# EAGLE design guimoOpen_PCB (EAGLE 7.6.0)
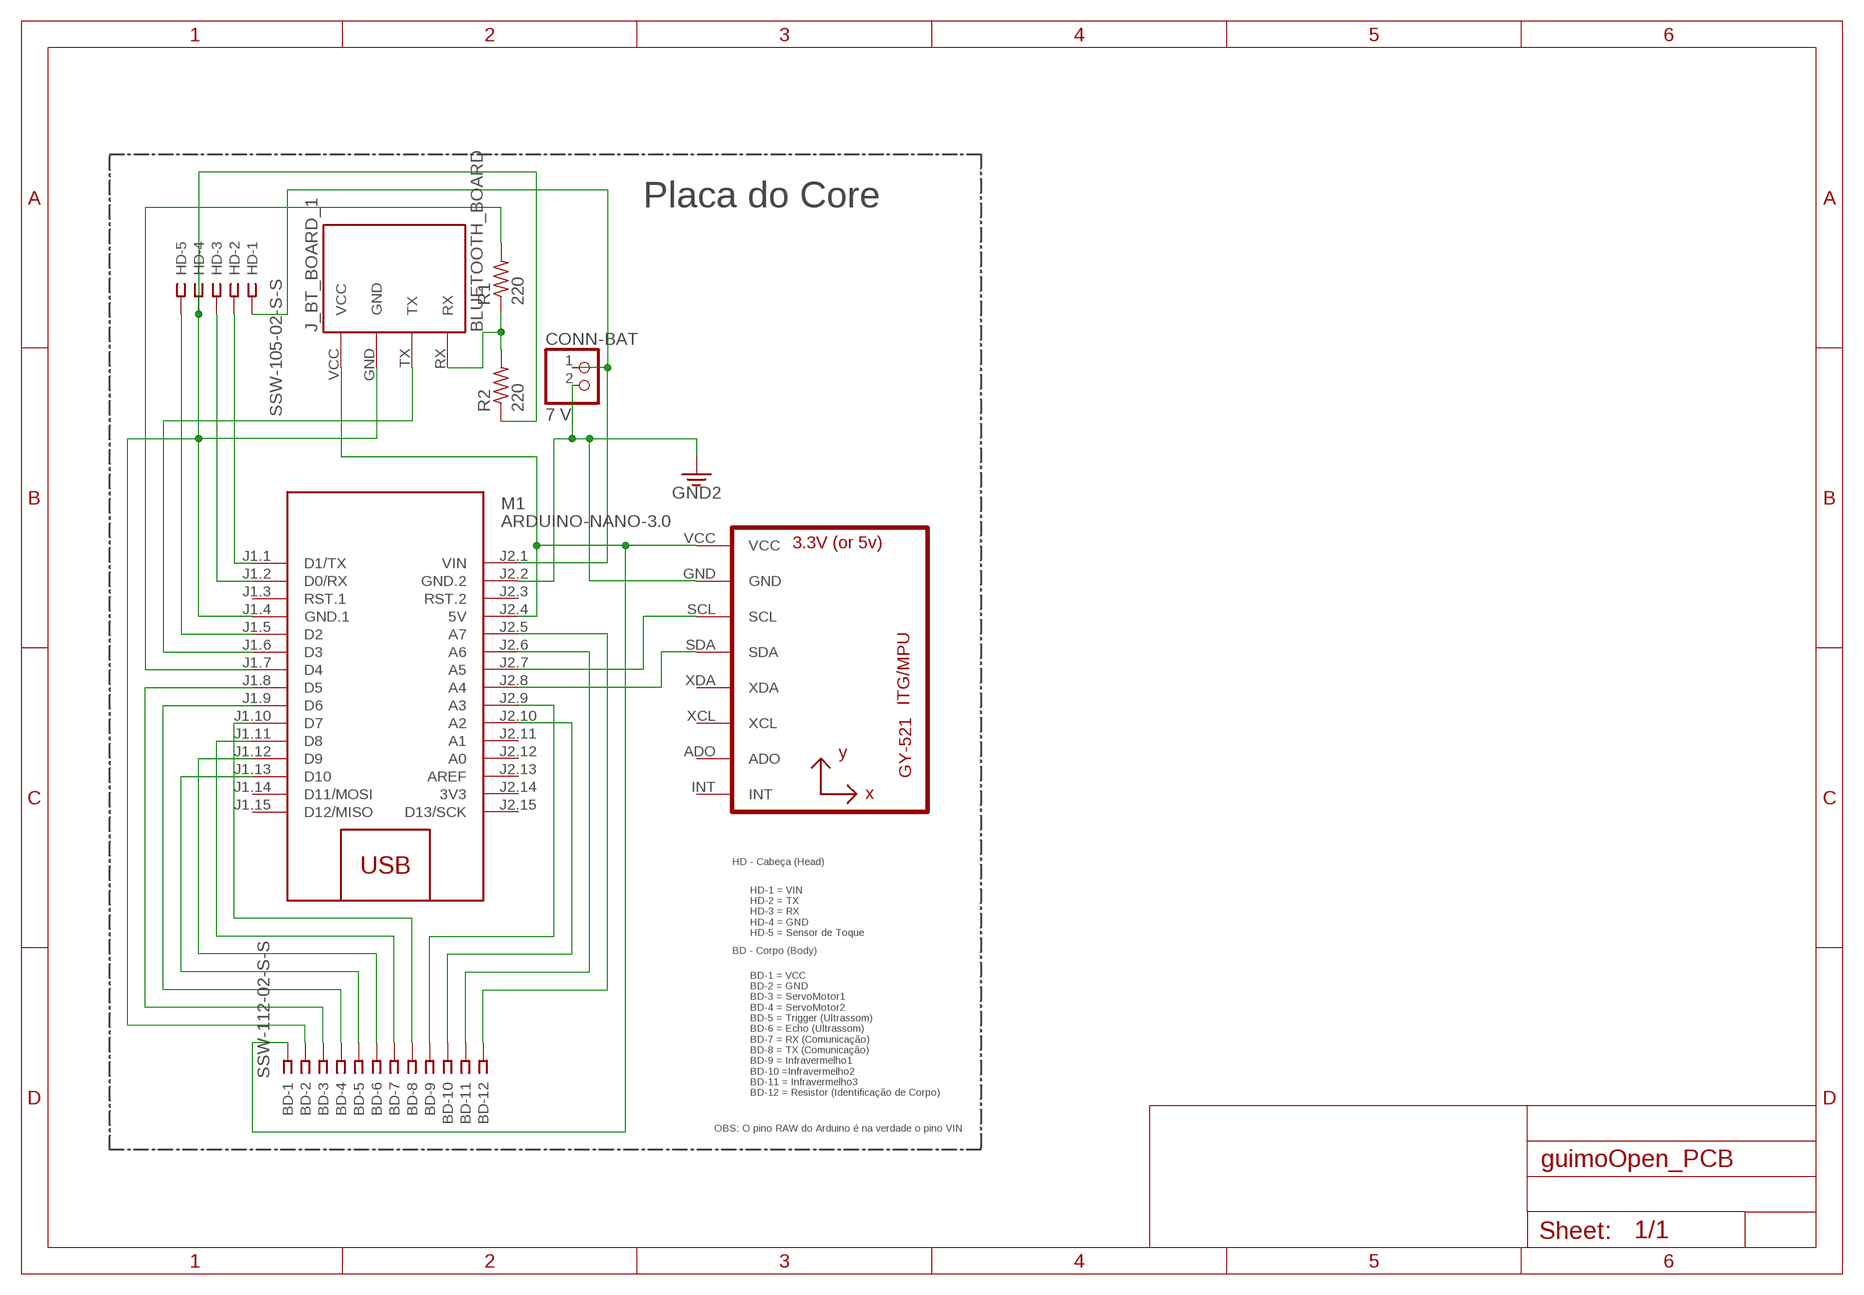
[diagram p0: schematic, sheet 1]

## Parts
BD  SSW-112-02-S-S  [SSW-112-02-S-S]
CONN-BAT  7 V  PINHD-1X2  [1X02]
HD  SSW-105-02-S-S  [SSW-105-02-S-S]
J_BT_BOARD_1  BLUETOOTH_BOARD  [BT_BOARD_FOOTPRINT]
M1  ARDUINO-NANO-3.0  [ARDUINO-NANO-3.0]
R1  220  R-US_0207/7  [0207/7]
R2  220  R-US_0207/7  [0207/7]
U1  GY-521MPU6050  [GY-521]

## Nets
GND: BD.2 HD.4 J_BT_BOARD_1.GND M1.J1.4(GND.1) R2.1
GND1: CONN-BAT.2 M1.J2.2(GND.2) U1.GND ; supply symbol labelled GND2
N$1: J_BT_BOARD_1.RX R1.1 R2.2
N$2: BD.1 J_BT_BOARD_1.VCC M1.J2.4(5V) U1.VCC
N$3: M1.J2.7(A5) U1.SCL
N$4: M1.J2.8(A4) U1.SDA
N$6: HD.5 M1.J1.5(D2)
N$7: CONN-BAT.1 HD.1 M1.J2.1(VIN)
N$8: M1.J1.7(D4) R1.2
N$9: BD.4 M1.J1.9(D6)
N$10: BD.6 M1.J1.12(D9)
N$11: BD.7 M1.J1.11(D8)
N$12: BD.5 M1.J1.13(D10)
N$13: BD.3 M1.J1.8(D5)
N$14: BD.8 M1.J1.10(D7)
N$15: BD.12 M1.J2.5(A7)
N$16: BD.11 M1.J2.6(A6)
N$17: J_BT_BOARD_1.TX M1.J1.6(D3)
N$18: HD.2 M1.J1.1(D1/TX)
N$19: BD.9 M1.J2.9(A3)
N$20: BD.10 M1.J2.10(A2)
N$21: HD.3 M1.J1.2(D0/RX)
Unconnected: M1.J1.3(RST.1) M1.J1.14(D11/MOSI) M1.J1.15(D12/MISO) M1.J2.3(RST.2) M1.J2.11(A1) M1.J2.12(A0) M1.J2.13(AREF) M1.J2.15(D13/SCK) U1.ADO U1.INT U1.XCL U1.XDA

## Notes on the sheet
- Placa do Core
- HD - Cabeça (Head)
- HD-1 = VIN
  HD-2 = TX
  HD-3 = RX
  HD-4 = GND
  HD-5 = Sensor de Toque
- BD - Corpo (Body)
- BD-1 = VCC
  BD-2 = GND
  BD-3 = ServoMotor1
  BD-4 = ServoMotor2
  BD-5 = Trigger (Ultrassom)
  BD-6 = Echo (Ultrassom)
  BD-7 = RX (Comunicação)
  BD-8 = TX (Comunicação)
  BD-9 = Infravermelho1
  BD-10 =Infravermelho2 
  BD-11 = Infravermelho3
  BD-12 = Resistor (Identificação de Corpo)
- OBS: O pino RAW do Arduino é na verdade o pino VIN

## Power pins joined to a net without a drawn wire
3V3: M1.J2.14(3V3)

## Library data of the parts
BD = con-samtec:SSW-112-02-S-S: THROUGH-HOLE .025" SQ POST SOCKET Source: Samtec SSW.pdf; MPN: SSW-112-02-S-S; OC_FARNELL: unknown; OC_NEWARK: 11P9515
CONN-BAT = pinhead:PINHD-1X2: PIN HEADER
HD = con-samtec:SSW-105-02-S-S: THROUGH-HOLE .025" SQ POST SOCKET Source: Samtec SSW.pdf; MPN: SSW-105-02-S-S; OC_FARNELL: unknown; OC_NEWARK: 11P9399
J_BT_BOARD_1 = bluetooth-HC-05:BLUETOOTH_BOARD: Bluetooth Board V1.05
M1 = diy-modules:ARDUINO-NANO-3.0: Arduino Nano 3.0 and compatible devices More details available here: https://www.arduino.cc/en/Main/ArduinoBoardNano Click here to find device on ebay.com <http://www.ebay.com/sch/arduino+nano>
R1 R2 = rcl:R-US_: RESISTOR, American symbol
U1 = gy-521_MPU-6050:GY-521

## Board
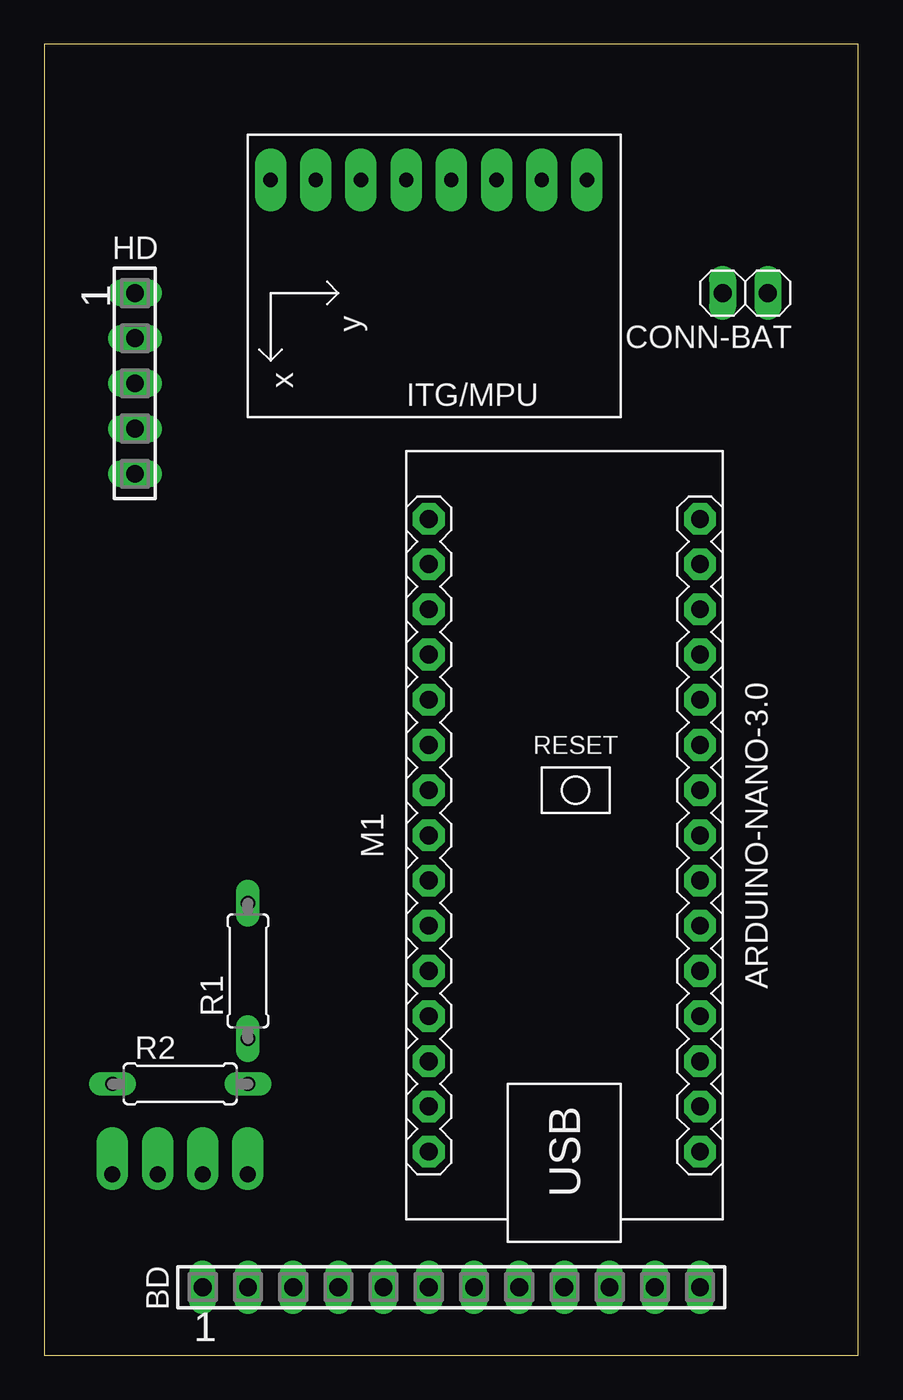
[diagram p1: board, top side]
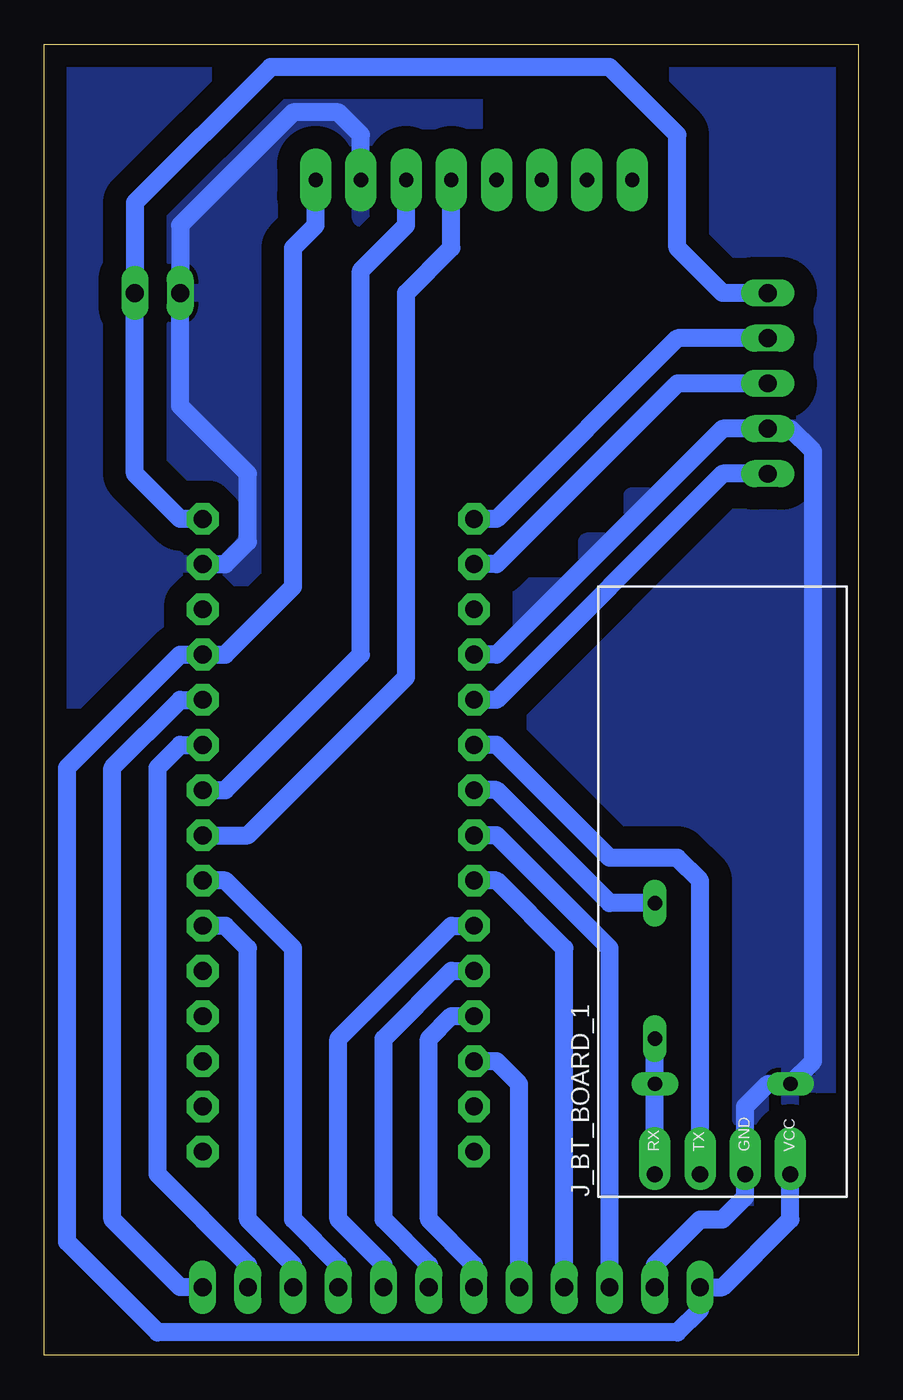
[diagram p2: board, bottom side, seen from below]

Size 45.72 x 73.66 mm. Coordinates in mm from the lower left corner, seen from the top.
Outline: 0,0 45.72,0 45.72,73.66 0,73.66 0,0
Copper layers (1*16): Top 0.035mm / dielectric 1.5mm / Bottom 0.035mm
Design rules "default *": minimum track width 30mil, minimum drill 24mil, track to track 12mil, track to pad 16mil, pad to pad 16mil, via to via 8mil, smd to smd 8mil, copper to edge 40mil, drill to drill 8mil, minimum pad ring 10mil, minimum via ring 8mil, stop-mask expansion 4mil, vias tented up to drill 0mil, thermal gap 10mil

### Footprints (pad centres in the part's own frame; a part is rotated, then mirrored left to right if it is on the bottom)
SSW-112-02-S-S = drill 1 pad 1.5 long: 1 -13.97,0; 2 -11.43,0; 3 -8.89,0; 4 -6.35,0; 5 -3.81,0; 6 -1.27,0; 7 1.27,0; 8 3.81,0; 9 6.35,0; 10 8.89,0; 11 11.43,0; 12 13.97,0
1X02 = drill 1.016 long: 1 -1.27,0; 2 1.27,0
SSW-105-02-S-S = drill 1 pad 1.5 long: 1 -5.08,0; 2 -2.54,0; 3 0,0; 4 2.54,0; 5 5.08,0
BT_BOARD_FOOTPRINT = drill 0.9 pad 1.778 offset: GND -16.51,-1.27; RX -16.51,3.81; TX -16.51,1.27; VCC -16.51,-3.81
ARDUINO-NANO-3.0 = drill 1 pad 1.778 octagon: J1.1 17.78,7.62; J1.2 15.24,7.62; J1.3 12.7,7.62; J1.4 10.16,7.62; J1.5 7.62,7.62; J1.6 5.08,7.62; J1.7 2.54,7.62; J1.8 0,7.62; J1.9 -2.54,7.62; J1.10 -5.08,7.62; J1.11 -7.62,7.62; J1.12 -10.16,7.62; J1.13 -12.7,7.62; J1.14 -15.24,7.62; J1.15 -17.78,7.62; J2.1 17.78,-7.62; J2.2 15.24,-7.62; J2.3 12.7,-7.62; J2.4 10.16,-7.62; J2.5 7.62,-7.62; J2.6 5.08,-7.62; J2.7 2.54,-7.62; J2.8 0,-7.62; J2.9 -2.54,-7.62; J2.10 -5.08,-7.62; J2.11 -7.62,-7.62; J2.12 -10.16,-7.62; J2.13 -12.7,-7.62; J2.14 -15.24,-7.62; J2.15 -17.78,-7.62
0207/7 = drill 0.813 long: 1 -3.81,0; 2 3.81,0
GY-521 = drill 0.8 pad 1.778 long: ADO -8.89,-6.35; GND -8.89,6.35; INT -8.89,-8.89; SCL -8.89,3.81; SDA -8.89,1.27; VCC -8.89,8.89; XCL -8.89,-3.81; XDA -8.89,-1.27

### Placement (x,y rotation side)
BD  22.86,3.81 0 top
CONN-BAT  39.37,59.69 180 top
HD  5.08,54.61 270 top
J_BT_BOARD_1  7.62,26.67 90 bottom
M1  29.21,29.21 90 top
R1  11.43,21.59 90 top
R2  7.62,15.24 0 top
U1  21.59,57.15 270 top

### Tracks (layer width: path | path; a pad name or v marks a point on that pad's centre or on a via)
GND
  Bottom 1.016: BD.2 11.43,5.08 8.89,7.62 7.62,7.62 6.35,8.89 J_BT_BOARD_1.GND 6.35,13.97 5.08,15.24 R2.1 2.54,16.51 2.54,50.8 3.81,52.07 HD.4 7.62,52.07 20.32,39.37 M1.J1.4
  pour Bottom (isolate 1.27): 0,73.66 13.97,73.66 13.97,55.88 5.08,55.88 5.08,50.8 8.89,50.8 8.89,48.26 12.7,48.26 12.7,45.72 15.24,45.72 15.24,43.18 19.05,43.18 19.05,39.37 20.32,39.37 20.32,34.29 20.32,8.89 3.81,8.89 3.81,15.24 0,15.24 0,72.39
GND1
  Bottom 1.016: U1.GND 27.94,68.58 29.21,69.85 31.75,69.85 38.1,63.5 CONN-BAT.2 38.1,53.34 34.29,49.53 34.29,45.72 35.56,44.45 M1.J2.2
  pour Bottom (isolate 1.27): 45.72,73.66 21.59,73.66 21.59,0 45.72,0
N$1
  Bottom 1.016: J_BT_BOARD_1.RX R2.2 R1.1
N$2
  Bottom 1.016: U1.VCC 30.48,63.5 31.75,62.23 31.75,43.18 35.56,39.37 M1.J2.4 38.1,39.37 44.45,33.02 44.45,6.35 39.37,1.27 10.16,1.27 8.89,2.54 BD.1 7.62,3.81 3.81,7.62 J_BT_BOARD_1.VCC
N$3
  Bottom 1.016: M1.J2.7 35.56,31.75 27.94,39.37 27.94,60.96 25.4,63.5 U1.SCL
N$4
  Bottom 1.016: M1.J2.8 34.29,29.21 25.4,38.1 25.4,59.69 22.86,62.23 U1.SDA
N$6
  Bottom 1.016: HD.5 7.62,49.53 20.32,36.83 M1.J1.5
N$7
  Bottom 1.016: M1.J2.1 38.1,46.99 40.64,49.53 CONN-BAT.1 40.64,64.77 33.02,72.39 13.97,72.39 10.16,68.58 10.16,62.23 7.62,59.69 HD.1
N$8
  Bottom 1.016: R1.2 13.97,25.4 20.32,31.75 M1.J1.7
N$9
  Bottom 1.016: BD.4 16.51,22.86 20.32,26.67 M1.J1.9
N$10
  Bottom 1.016: BD.6 21.59,5.08 24.13,7.62 24.13,17.78 22.86,19.05 M1.J1.12
N$11
  Bottom 1.016: BD.7 24.13,5.08 26.67,7.62 26.67,17.78 22.86,21.59 M1.J1.11
N$12
  Bottom 1.016: BD.5 19.05,15.24 20.32,16.51 M1.J1.13
N$13
  Bottom 1.016: BD.3 13.97,22.86 20.32,29.21 M1.J1.8
N$14
  Bottom 1.016: BD.8 26.67,5.08 29.21,7.62 29.21,17.78 22.86,24.13 M1.J1.10
N$15
  Bottom 1.016: BD.12 38.1,3.81 41.91,7.62 41.91,33.02 38.1,36.83 M1.J2.5
N$16
  Bottom 1.016: BD.11 34.29,5.08 39.37,10.16 39.37,33.02 38.1,34.29 M1.J2.6
N$17
  Bottom 1.016: J_BT_BOARD_1.TX 8.89,26.67 10.16,27.94 13.97,27.94 20.32,34.29 M1.J1.6
N$18
  Bottom 1.016: HD.2 10.16,57.15 20.32,46.99 M1.J1.1
N$19
  Bottom 1.016: BD.9 29.21,5.08 31.75,7.62 31.75,22.86 35.56,26.67 M1.J2.9
N$20
  Bottom 1.016: BD.10 31.75,5.08 34.29,7.62 34.29,22.86 35.56,24.13 M1.J2.10
N$21
  Bottom 1.016: HD.3 10.16,54.61 20.32,44.45 M1.J1.2